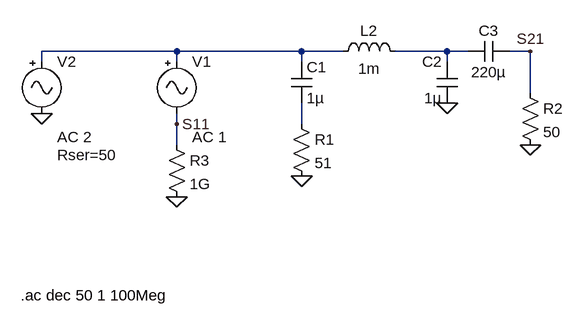
[diagram p0: schematic AF Diplexer.asc]
AF Diplexer.asc, the LTspice schematic file:
Version 4
SHEET 1 880 680
WIRE -160 128 -368 128
WIRE 32 128 -160 128
WIRE 96 128 32 128
WIRE 256 128 176 128
WIRE 288 128 256 128
WIRE 384 128 352 128
WIRE -368 144 -368 128
WIRE -160 144 -160 128
WIRE 32 144 32 128
WIRE 256 144 256 128
WIRE 384 192 384 128
WIRE -160 240 -160 224
WIRE 32 240 32 208
WIRE -160 272 -160 240
FLAG 256 208 0
FLAG 384 272 0
FLAG 32 320 0
FLAG -160 352 0
FLAG -368 224 0
FLAG 384 128 S21
FLAG -160 240 S11
SYMBOL res 16 224 R0
SYMATTR InstName R1
SYMATTR Value 51
SYMBOL res 368 176 R0
SYMATTR InstName R2
SYMATTR Value 50
SYMBOL cap 16 144 R0
SYMATTR InstName C1
SYMATTR Value 1µ
SYMBOL cap 272 208 R180
WINDOW 0 24 64 Left 0
WINDOW 3 24 8 Left 0
SYMATTR InstName C2
SYMATTR Value 1µ
SYMBOL ind 80 144 R270
WINDOW 0 32 56 VTop 0
WINDOW 3 5 56 VBottom 0
SYMATTR InstName L2
SYMATTR Value 1m
SYMBOL res -176 256 R0
SYMATTR InstName R3
SYMATTR Value 1G
SYMBOL Misc\\signal -160 128 R0
WINDOW 123 24 132 Left 0
WINDOW 39 0 0 Left 0
SYMATTR Value2 AC 1
SYMATTR InstName V1
SYMATTR Value ""
SYMBOL Misc\\signal -368 128 R0
WINDOW 123 24 132 Left 0
WINDOW 39 24 160 Left 0
SYMATTR Value2 AC 2
SYMATTR SpiceLine Rser=50
SYMATTR InstName V2
SYMATTR Value ""
SYMBOL cap 352 112 R90
WINDOW 0 0 32 VBottom 0
WINDOW 3 32 32 VTop 0
SYMATTR InstName C3
SYMATTR Value 220µ
TEXT -400 504 Left 0 !.ac dec 50 1 100Meg

The netlist it stands for:
* AF Diplexer.asc
R1 N003 0 51
R2 S21 0 50
C1 N001 N003 1µ
C2 0 N002 1µ
L2 N001 N002 1m
R3 S11 0 1G
V1 N001 S11 AC 1
V2 N001 0 AC 2 Rser=50
C3 S21 N002 220µ
.ac dec 50 1 100Meg
.backanno
.end